# Altium schematic sheet Main.SchDoc
size A; SheetNumber: 1; SheetTotal: 2
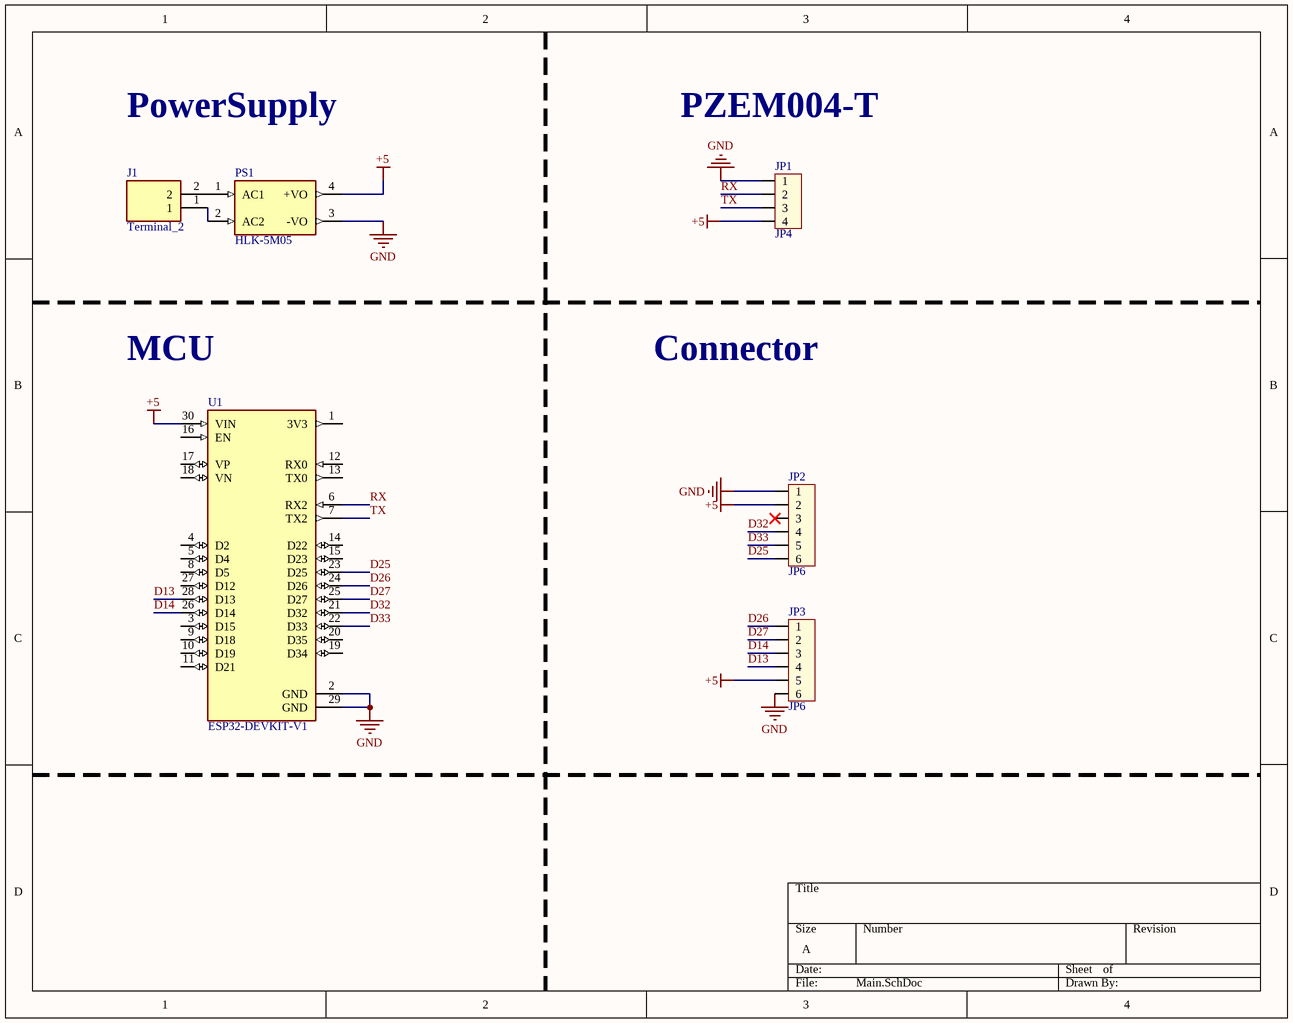
[diagram p0: Main.SchDoc]

## Parts
J1  Terminal_2  [TE_282843-2]
JP1  JP4  [CON4]
JP2  JP6  [CON6]
JP3  JP6  [CON6]
PS1  HLK-5M05  [CONV_HLK-5M05]
U1  ESP32-DEVKIT-V1  [MODULE_ESP32_DEVKIT_V1]

## Nets
+5: JP1.4 JP2.2 JP3.5 PS1.4(+VO) U1.30(VIN)
GND: JP1.1 JP2.1 JP3.6 PS1.3(-VO) U1.2(GND) U1.29(GND)
D13: JP3.4 U1.28(D13)
D14: JP3.3 U1.26(D14)
D25: JP2.6 U1.23(D25)
D26: JP3.1 U1.24(D26)
D27: JP3.2 U1.25(D27)
D32: JP2.4 U1.21(D32)
D33: JP2.5 U1.22(D33)
RX: JP1.2 U1.6(RX2)
TX: JP1.3 U1.7(TX2)
NetJ1_1: J1.1 PS1.2(AC2)
NetJ1_2: J1.2 PS1.1(AC1)

Not connected (* = marked no-connect by the designer): JP2 3*; U1 1(3V3) 3(D15) 4(D2) 5(D4) 8(D5) 9(D18) 10(D19) 11(D21) 12(RX0) 13(TX0) 14(D22) 15(D23) 16(EN) 17(VP) 18(VN) 19(D34) 20(D35) 27(D12)

## Notes on the sheet
- PowerSupply
- PZEM004-T
- MCU
- Connector

## Library data of the parts
J1 = 282843-2: MF: {'manufacturer': 'TE Connectivity'}; Availability: Unavailable; MP: 282843-2; Value: *; Package: None; Price: None
JP1 = Con4: Connector 4; Value: Connector 4
JP2 JP3 = Con6: Connector 6; Value: Connector 6
PS1 = HLK-5M05: AC DC 220V to 5V 5W 5Watt Isolated Switching Step-Down Power Supply Module Converter; MF: Hi-link; Check_prices: https://www.snapeda.com/parts/HLK-5M05/Hi-link/view-part/?ref=eda; SnapEDA_Link: https://www.snapeda.com/parts/HLK-5M05/Hi-link/view-part/?ref=snap; Price: None; Availability: Not in stock; Package: Package; MP: HLK-5M05; Value: *
U1 = ESP32-DEVKIT-V1: Dual core, Wi-Fi: 2.4 GHz up to 150 Mbits/s,BLE (Bluetooth Low Energy) and legacy Bluetooth, 32 bits, Up to 240 MHz; MF: Do it; Price: None; Availability: Not in stock; Package: None; MP: ESP32-DEVKIT-V1; Value: *; SnapEDA_Link: https://www.snapeda.com/parts/ESP32-DEVKIT-V1/Do+it/view-part/?ref=snap; Check_prices: https://www.snapeda.com/parts/ESP32-DEVKIT-V1/Do+it/view-part/?ref=eda